# Altium schematic sheet MODULE.SchDoc: MODULE
size A3; Author: Silvio Navaretti; CompanyName: ARDUINO; DrawnBy: Silvio Navaretti; Engineer: Silvio Navaretti; Organization: ARDUINO; SheetNumber: 2; SheetTotal: 51; RevAuthor: Silvio Navaretti
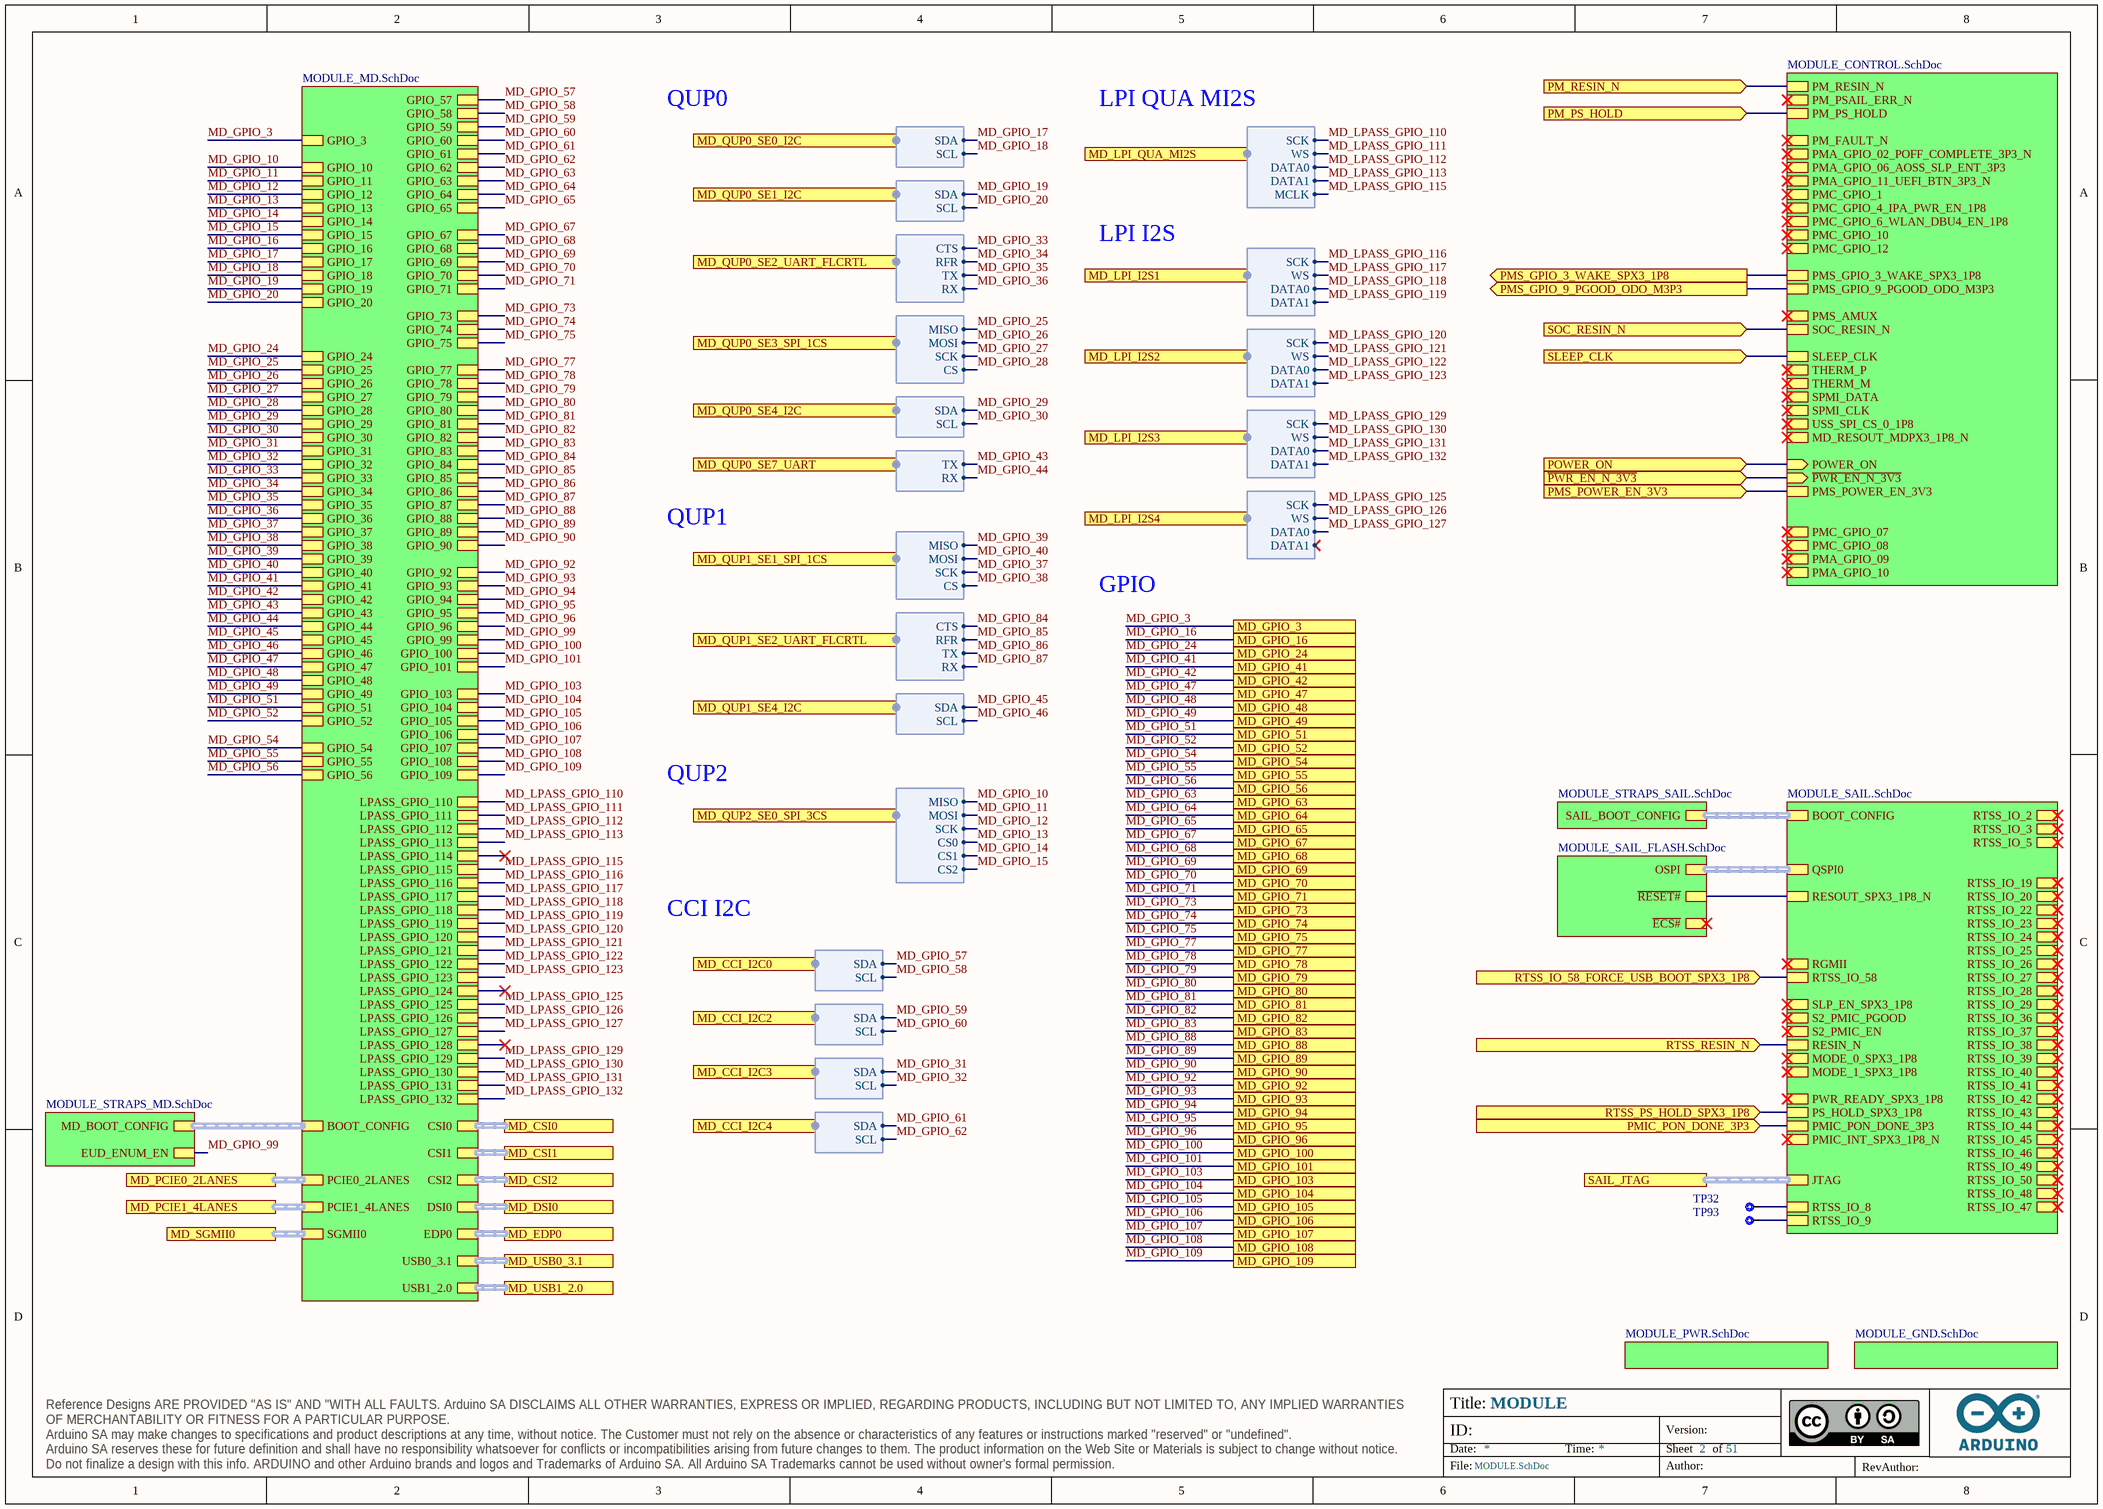
[diagram p0: MODULE.SchDoc]

## Parts
TP32  Test point 1.00mm  [TP-1.00MM]  (value not drawn)  (no BOM)
TP93  Test point 1.00mm  [TP-1.00MM]  (value not drawn)  (no BOM)

## Sub-sheets
MODULE_CONTROL = MODULE_CONTROL.SchDoc: PM_RESIN_N, PM_PSAIL_ERR_N, PM_PS_HOLD, PM_FAULT_N, PMA_GPIO_02_POFF_COMPLETE_3P3_N, PMA_GPIO_06_AOSS_SLP_ENT_3P3, PMA_GPIO_11_UEFI_BTN_3P3_N, PMC_GPIO_1, PMC_GPIO_4_IPA_PWR_EN_1P8, PMC_GPIO_6_WLAN_DBU4_EN_1P8, PMC_GPIO_10, PMC_GPIO_12, PMS_GPIO_3_WAKE_SPX3_1P8, PMS_GPIO_9_PGOOD_ODO_M3P3, PMS_AMUX, SOC_RESIN_N, SLEEP_CLK, THERM_P, THERM_M, SPMI_DATA, SPMI_CLK, USS_SPI_CS_0_1P8, MD_RESOUT_MDPX3_1P8_N, POWER_ON (in), ~{PWR_EN_N_3V3} (in), PMA_GPIO_09, PMA_GPIO_10, PMC_GPIO_07, PMC_GPIO_08, PMS_POWER_EN_3V3
MODULE_GND = MODULE_GND.SchDoc: no entries
MODULE_PWR = MODULE_PWR.SchDoc: no entries
MODULE_SAIL = MODULE_SAIL.SchDoc: JTAG (harness SOM_SAIL_JTAG), RGMII (harness SOM_SAIL_RGMII), SLP_EN_SPX3_1P8, S2_PMIC_PGOOD, S2_PMIC_EN, RESIN_N, MODE_0_SPX3_1P8, MODE_1_SPX3_1P8, PWR_READY_SPX3_1P8, PS_HOLD_SPX3_1P8, PMIC_PON_DONE_3P3, PMIC_INT_SPX3_1P8_N, BOOT_CONFIG (harness SOM_SAIL_BOOT_CONFIG), RTSS_IO_2, RTSS_IO_3, RTSS_IO_5, RTSS_IO_8, RTSS_IO_9, RTSS_IO_19, RTSS_IO_20, RTSS_IO_22, RTSS_IO_23, RTSS_IO_24, RTSS_IO_25, RTSS_IO_26, RTSS_IO_27, RTSS_IO_28, RTSS_IO_29, RTSS_IO_36, RTSS_IO_37, RTSS_IO_38, RTSS_IO_39, RTSS_IO_40, RTSS_IO_41, RTSS_IO_42, RTSS_IO_43, RTSS_IO_44, RTSS_IO_45, RTSS_IO_46, RTSS_IO_49, RTSS_IO_50, RTSS_IO_58, RTSS_IO_48, RTSS_IO_47, RESOUT_SPX3_1P8_N, QSPI0 (harness SOM_SAIL_QSPI0)
MODULE_SAIL_FLASH = MODULE_SAIL_FLASH.SchDoc: ~{RESET#}, ~{ECS#}, OSPI (harness SOM_SAIL_QSPI0)
MODULE_STRAPS_MD = MODULE_STRAPS_MD.SchDoc: MD_BOOT_CONFIG (harness SOM_MD_BOOT_CONFIG), EUD_ENUM_EN
MODULE_STRAPS_SAIL = MODULE_STRAPS_SAIL.SchDoc: SAIL_BOOT_CONFIG (harness SOM_SAIL_BOOT_CONFIG)
U_SOM_MD = MODULE_MD.SchDoc: GPIO_3, GPIO_10, GPIO_11, GPIO_12, GPIO_13, GPIO_14, GPIO_15, GPIO_16, GPIO_17, GPIO_18, GPIO_19, GPIO_20, GPIO_24, GPIO_25, GPIO_26, GPIO_27, GPIO_28, GPIO_29, GPIO_30, GPIO_31, GPIO_32, GPIO_33, GPIO_34, GPIO_35, GPIO_36, GPIO_37, GPIO_38, GPIO_39, GPIO_40, GPIO_42, GPIO_43, GPIO_45, GPIO_46, GPIO_47, GPIO_48, GPIO_52, GPIO_54, GPIO_55, GPIO_56, GPIO_57, GPIO_58, GPIO_59, GPIO_60, GPIO_61, GPIO_62, GPIO_63, GPIO_64, GPIO_65, GPIO_67, GPIO_68, GPIO_69, GPIO_70, GPIO_71, GPIO_73, GPIO_74, GPIO_75, GPIO_77, GPIO_78, GPIO_79, GPIO_80, GPIO_81, GPIO_83, GPIO_84, GPIO_85, GPIO_86, GPIO_87, GPIO_88, GPIO_89, GPIO_90, GPIO_92, GPIO_93, GPIO_94, GPIO_95, GPIO_99, GPIO_100, GPIO_101, GPIO_104, GPIO_105, GPIO_106, GPIO_107, GPIO_108, GPIO_109, LPASS_GPIO_110, LPASS_GPIO_111, LPASS_GPIO_112, LPASS_GPIO_113, LPASS_GPIO_114, LPASS_GPIO_115, LPASS_GPIO_116, LPASS_GPIO_117, LPASS_GPIO_118, LPASS_GPIO_119, LPASS_GPIO_120, LPASS_GPIO_121, LPASS_GPIO_122, LPASS_GPIO_123, LPASS_GPIO_124, LPASS_GPIO_125, LPASS_GPIO_126, LPASS_GPIO_127, LPASS_GPIO_128, LPASS_GPIO_129, LPASS_GPIO_130, LPASS_GPIO_131, LPASS_GPIO_132, SGMII0 (harness SOM_MD_SGMII0), EDP0 (harness SOM_MD_EDP0), USB0_3.1 (harness SOM_MD_USB0), USB1_2.0 (harness SOM_MD_USB1), PCIE1_4LANES (harness SOM_MD_PCIE1), BOOT_CONFIG (harness SOM_MD_BOOT_CONFIG), GPIO_44, CSI0 (harness MIPI_4LANES), CSI1 (harness MIPI_4LANES), CSI2 (harness MIPI_4LANES), DSI0 (harness MIPI_4LANES), GPIO_103, GPIO_82, GPIO_41, GPIO_96, GPIO_49, GPIO_51, PCIE0_2LANES (harness SOM_MD_PCIE0)

## Ports
MD_CCI_I2C0 (harness I2C), MD_CCI_I2C2 (harness I2C), MD_CCI_I2C3 (harness I2C), MD_CCI_I2C4 (harness I2C), MD_CSI0, MD_CSI1, MD_CSI2, MD_DSI0, MD_EDP0, MD_GPIO_3, MD_GPIO_16, MD_GPIO_24, MD_GPIO_41, MD_GPIO_42, MD_GPIO_47, MD_GPIO_48, MD_GPIO_49, MD_GPIO_51, MD_GPIO_52, MD_GPIO_54, MD_GPIO_55, MD_GPIO_56, MD_GPIO_63, MD_GPIO_64, MD_GPIO_65, MD_GPIO_67, MD_GPIO_68, MD_GPIO_69, MD_GPIO_70, MD_GPIO_71, MD_GPIO_73, MD_GPIO_74, MD_GPIO_75, MD_GPIO_77, MD_GPIO_78, MD_GPIO_79, MD_GPIO_80, MD_GPIO_81, MD_GPIO_82, MD_GPIO_83, MD_GPIO_88, MD_GPIO_89, MD_GPIO_90, MD_GPIO_92, MD_GPIO_93, MD_GPIO_94, MD_GPIO_95, MD_GPIO_96, MD_GPIO_100, MD_GPIO_101, MD_GPIO_103, MD_GPIO_104, MD_GPIO_105, MD_GPIO_106, MD_GPIO_107, MD_GPIO_108, MD_GPIO_109, MD_LPI_I2S1 (harness SOM_MD_I2S), MD_LPI_I2S2 (harness SOM_MD_I2S), MD_LPI_I2S3 (harness SOM_MD_I2S), MD_LPI_I2S4 (harness SOM_MD_I2S), MD_LPI_QUA_MI2S (harness SOM_MD_I2S_QUA), MD_PCIE0_2LANES, MD_PCIE1_4LANES, MD_QUP0_SE0_I2C (harness I2C), MD_QUP0_SE1_I2C (harness I2C), MD_QUP0_SE2_UART_FLCRTL (harness SOM_MD_UART_FLCRTL), MD_QUP0_SE3_SPI_1CS (harness SPI), MD_QUP0_SE4_I2C (harness I2C), MD_QUP0_SE7_UART (harness UART), MD_QUP1_SE1_SPI_1CS (harness SPI), MD_QUP1_SE2_UART_FLCRTL (harness SOM_MD_UART_FLCRTL), MD_QUP1_SE4_I2C (harness I2C), MD_QUP2_SE0_SPI_3CS (harness SOM_MD_SPI_3CS), MD_SGMII0, MD_USB0_3.1, MD_USB1_2.0, PM_PS_HOLD (in), PM_RESIN_N (in), PMIC_PON_DONE_3P3 (in), PMS_GPIO_3_WAKE_SPX3_1P8 (out), PMS_GPIO_9_PGOOD_ODO_M3P3 (out), PMS_POWER_EN_3V3 (in), POWER_ON (in), RTSS_IO_58_FORCE_USB_BOOT_SPX3_1P8 (in), RTSS_PS_HOLD_SPX3_1P8 (in), RTSS_RESIN_N (in), SAIL_JTAG, SLEEP_CLK (in), SOC_RESIN_N (in), ~{PWR_EN_N_3V3} (in)

## Harnesses
I2C: SDA, SCL
SOM_MD_I2S_QUA: SCK, WS, DATA0, DATA1, MCLK
SOM_MD_I2S: SCK, WS, DATA0, DATA1
SPI: SCK, MISO, MOSI, CS
SOM_MD_UART_FLCRTL: TX, CTS, RFR, RX
UART: TX, RX
SOM_MD_SPI_3CS: SCK, MISO, MOSI, CS0, CS1, CS2

## Nets
MD_GPIO_3: port MD_GPIO_3, sheet U_SOM_MD/GPIO_3
MD_GPIO_10: sheet U_SOM_MD/GPIO_10, port MD_QUP2_SE0_SPI_3CS.MISO
MD_GPIO_11: sheet U_SOM_MD/GPIO_11, port MD_QUP2_SE0_SPI_3CS.MOSI
MD_GPIO_12: sheet U_SOM_MD/GPIO_12, port MD_QUP2_SE0_SPI_3CS.SCK
MD_GPIO_13: sheet U_SOM_MD/GPIO_13, port MD_QUP2_SE0_SPI_3CS.CS0
MD_GPIO_14: sheet U_SOM_MD/GPIO_14, port MD_QUP2_SE0_SPI_3CS.CS1
MD_GPIO_15: sheet U_SOM_MD/GPIO_15, port MD_QUP2_SE0_SPI_3CS.CS2
MD_GPIO_16: port MD_GPIO_16, sheet U_SOM_MD/GPIO_16
MD_GPIO_17: sheet U_SOM_MD/GPIO_17, port MD_QUP0_SE0_I2C.SDA
MD_GPIO_18: sheet U_SOM_MD/GPIO_18, port MD_QUP0_SE0_I2C.SCL
MD_GPIO_19: sheet U_SOM_MD/GPIO_19, port MD_QUP0_SE1_I2C.SDA
MD_GPIO_20: sheet U_SOM_MD/GPIO_20, port MD_QUP0_SE1_I2C.SCL
MD_GPIO_24: port MD_GPIO_24, sheet U_SOM_MD/GPIO_24
MD_GPIO_25: sheet U_SOM_MD/GPIO_25, port MD_QUP0_SE3_SPI_1CS.MISO
MD_GPIO_26: sheet U_SOM_MD/GPIO_26, port MD_QUP0_SE3_SPI_1CS.MOSI
MD_GPIO_27: sheet U_SOM_MD/GPIO_27, port MD_QUP0_SE3_SPI_1CS.SCK
MD_GPIO_28: sheet U_SOM_MD/GPIO_28, port MD_QUP0_SE3_SPI_1CS.CS
MD_GPIO_29: sheet U_SOM_MD/GPIO_29, port MD_QUP0_SE4_I2C.SDA
MD_GPIO_30: sheet U_SOM_MD/GPIO_30, port MD_QUP0_SE4_I2C.SCL
MD_GPIO_31: sheet U_SOM_MD/GPIO_31, port MD_CCI_I2C3.SDA
MD_GPIO_32: sheet U_SOM_MD/GPIO_32, port MD_CCI_I2C3.SCL
MD_GPIO_33: sheet U_SOM_MD/GPIO_33, port MD_QUP0_SE2_UART_FLCRTL.CTS
MD_GPIO_34: sheet U_SOM_MD/GPIO_34, port MD_QUP0_SE2_UART_FLCRTL.RFR
MD_GPIO_35: sheet U_SOM_MD/GPIO_35, port MD_QUP0_SE2_UART_FLCRTL.TX
MD_GPIO_36: sheet U_SOM_MD/GPIO_36, port MD_QUP0_SE2_UART_FLCRTL.RX
MD_GPIO_37: sheet U_SOM_MD/GPIO_37, port MD_QUP1_SE1_SPI_1CS.SCK
MD_GPIO_38: sheet U_SOM_MD/GPIO_38, port MD_QUP1_SE1_SPI_1CS.CS
MD_GPIO_39: sheet U_SOM_MD/GPIO_39, port MD_QUP1_SE1_SPI_1CS.MISO
MD_GPIO_40: sheet U_SOM_MD/GPIO_40, port MD_QUP1_SE1_SPI_1CS.MOSI
MD_GPIO_41: port MD_GPIO_41, sheet U_SOM_MD/GPIO_41
MD_GPIO_42: port MD_GPIO_42, sheet U_SOM_MD/GPIO_42
MD_GPIO_43: sheet U_SOM_MD/GPIO_43, port MD_QUP0_SE7_UART.TX
MD_GPIO_44: sheet U_SOM_MD/GPIO_44, port MD_QUP0_SE7_UART.RX
MD_GPIO_45: sheet U_SOM_MD/GPIO_45, port MD_QUP1_SE4_I2C.SDA
MD_GPIO_46: sheet U_SOM_MD/GPIO_46, port MD_QUP1_SE4_I2C.SCL
MD_GPIO_47: port MD_GPIO_47, sheet U_SOM_MD/GPIO_47
MD_GPIO_48: port MD_GPIO_48, sheet U_SOM_MD/GPIO_48
MD_GPIO_49: port MD_GPIO_49, sheet U_SOM_MD/GPIO_49
MD_GPIO_51: port MD_GPIO_51, sheet U_SOM_MD/GPIO_51
MD_GPIO_52: port MD_GPIO_52, sheet U_SOM_MD/GPIO_52
MD_GPIO_54: port MD_GPIO_54, sheet U_SOM_MD/GPIO_54
MD_GPIO_55: port MD_GPIO_55, sheet U_SOM_MD/GPIO_55
MD_GPIO_56: port MD_GPIO_56, sheet U_SOM_MD/GPIO_56
MD_GPIO_57: sheet U_SOM_MD/GPIO_57, port MD_CCI_I2C0.SDA
MD_GPIO_58: sheet U_SOM_MD/GPIO_58, port MD_CCI_I2C0.SCL
MD_GPIO_59: sheet U_SOM_MD/GPIO_59, port MD_CCI_I2C2.SDA
MD_GPIO_60: sheet U_SOM_MD/GPIO_60, port MD_CCI_I2C2.SCL
MD_GPIO_61: sheet U_SOM_MD/GPIO_61, port MD_CCI_I2C4.SDA
MD_GPIO_62: sheet U_SOM_MD/GPIO_62, port MD_CCI_I2C4.SCL
MD_GPIO_63: port MD_GPIO_63, sheet U_SOM_MD/GPIO_63
MD_GPIO_64: port MD_GPIO_64, sheet U_SOM_MD/GPIO_64
MD_GPIO_65: port MD_GPIO_65, sheet U_SOM_MD/GPIO_65
MD_GPIO_67: port MD_GPIO_67, sheet U_SOM_MD/GPIO_67
MD_GPIO_68: port MD_GPIO_68, sheet U_SOM_MD/GPIO_68
MD_GPIO_69: port MD_GPIO_69, sheet U_SOM_MD/GPIO_69
MD_GPIO_70: port MD_GPIO_70, sheet U_SOM_MD/GPIO_70
MD_GPIO_71: port MD_GPIO_71, sheet U_SOM_MD/GPIO_71
MD_GPIO_73: port MD_GPIO_73, sheet U_SOM_MD/GPIO_73
MD_GPIO_74: port MD_GPIO_74, sheet U_SOM_MD/GPIO_74
MD_GPIO_75: port MD_GPIO_75, sheet U_SOM_MD/GPIO_75
MD_GPIO_77: port MD_GPIO_77, sheet U_SOM_MD/GPIO_77
MD_GPIO_78: port MD_GPIO_78, sheet U_SOM_MD/GPIO_78
MD_GPIO_79: port MD_GPIO_79, sheet U_SOM_MD/GPIO_79
MD_GPIO_80: port MD_GPIO_80, sheet U_SOM_MD/GPIO_80
MD_GPIO_81: port MD_GPIO_81, sheet U_SOM_MD/GPIO_81
MD_GPIO_82: port MD_GPIO_82, sheet U_SOM_MD/GPIO_82
MD_GPIO_83: port MD_GPIO_83, sheet U_SOM_MD/GPIO_83
MD_GPIO_84: sheet U_SOM_MD/GPIO_84, port MD_QUP1_SE2_UART_FLCRTL.CTS
MD_GPIO_85: sheet U_SOM_MD/GPIO_85, port MD_QUP1_SE2_UART_FLCRTL.RFR
MD_GPIO_86: sheet U_SOM_MD/GPIO_86, port MD_QUP1_SE2_UART_FLCRTL.TX
MD_GPIO_87: sheet U_SOM_MD/GPIO_87, port MD_QUP1_SE2_UART_FLCRTL.RX
MD_GPIO_88: port MD_GPIO_88, sheet U_SOM_MD/GPIO_88
MD_GPIO_89: port MD_GPIO_89, sheet U_SOM_MD/GPIO_89
MD_GPIO_90: port MD_GPIO_90, sheet U_SOM_MD/GPIO_90
MD_GPIO_92: port MD_GPIO_92, sheet U_SOM_MD/GPIO_92
MD_GPIO_93: port MD_GPIO_93, sheet U_SOM_MD/GPIO_93
MD_GPIO_94: port MD_GPIO_94, sheet U_SOM_MD/GPIO_94
MD_GPIO_95: port MD_GPIO_95, sheet U_SOM_MD/GPIO_95
MD_GPIO_96: port MD_GPIO_96, sheet U_SOM_MD/GPIO_96
MD_GPIO_99: sheet U_SOM_MD/GPIO_99, sheet MODULE_STRAPS_MD/EUD_ENUM_EN
MD_GPIO_100: port MD_GPIO_100, sheet U_SOM_MD/GPIO_100
MD_GPIO_101: port MD_GPIO_101, sheet U_SOM_MD/GPIO_101
MD_GPIO_103: port MD_GPIO_103, sheet U_SOM_MD/GPIO_103
MD_GPIO_104: port MD_GPIO_104, sheet U_SOM_MD/GPIO_104
MD_GPIO_105: port MD_GPIO_105, sheet U_SOM_MD/GPIO_105
MD_GPIO_106: port MD_GPIO_106, sheet U_SOM_MD/GPIO_106
MD_GPIO_107: port MD_GPIO_107, sheet U_SOM_MD/GPIO_107
MD_GPIO_108: port MD_GPIO_108, sheet U_SOM_MD/GPIO_108
MD_GPIO_109: port MD_GPIO_109, sheet U_SOM_MD/GPIO_109
MD_LPASS_GPIO_110: sheet U_SOM_MD/LPASS_GPIO_110, port MD_LPI_QUA_MI2S.SCK
MD_LPASS_GPIO_111: sheet U_SOM_MD/LPASS_GPIO_111, port MD_LPI_QUA_MI2S.WS
MD_LPASS_GPIO_112: sheet U_SOM_MD/LPASS_GPIO_112, port MD_LPI_QUA_MI2S.DATA0
MD_LPASS_GPIO_113: sheet U_SOM_MD/LPASS_GPIO_113, port MD_LPI_QUA_MI2S.DATA1
MD_LPASS_GPIO_115: sheet U_SOM_MD/LPASS_GPIO_115, port MD_LPI_QUA_MI2S.MCLK
MD_LPASS_GPIO_116: sheet U_SOM_MD/LPASS_GPIO_116, port MD_LPI_I2S1.SCK
MD_LPASS_GPIO_117: sheet U_SOM_MD/LPASS_GPIO_117, port MD_LPI_I2S1.WS
MD_LPASS_GPIO_118: sheet U_SOM_MD/LPASS_GPIO_118, port MD_LPI_I2S1.DATA0
MD_LPASS_GPIO_119: sheet U_SOM_MD/LPASS_GPIO_119, port MD_LPI_I2S1.DATA1
MD_LPASS_GPIO_120: sheet U_SOM_MD/LPASS_GPIO_120, port MD_LPI_I2S2.SCK
MD_LPASS_GPIO_121: sheet U_SOM_MD/LPASS_GPIO_121, port MD_LPI_I2S2.WS
MD_LPASS_GPIO_122: sheet U_SOM_MD/LPASS_GPIO_122, port MD_LPI_I2S2.DATA0
MD_LPASS_GPIO_123: sheet U_SOM_MD/LPASS_GPIO_123, port MD_LPI_I2S2.DATA1
MD_LPASS_GPIO_125: sheet U_SOM_MD/LPASS_GPIO_125, port MD_LPI_I2S4.SCK
MD_LPASS_GPIO_126: sheet U_SOM_MD/LPASS_GPIO_126, port MD_LPI_I2S4.WS
MD_LPASS_GPIO_127: sheet U_SOM_MD/LPASS_GPIO_127, port MD_LPI_I2S4.DATA0
MD_LPASS_GPIO_129: sheet U_SOM_MD/LPASS_GPIO_129, port MD_LPI_I2S3.SCK
MD_LPASS_GPIO_130: sheet U_SOM_MD/LPASS_GPIO_130, port MD_LPI_I2S3.WS
MD_LPASS_GPIO_131: sheet U_SOM_MD/LPASS_GPIO_131, port MD_LPI_I2S3.DATA0
MD_LPASS_GPIO_132: sheet U_SOM_MD/LPASS_GPIO_132, port MD_LPI_I2S3.DATA1
~{PWR_EN_N_3V3}: port ~{PWR_EN_N_3V3}, sheet MODULE_CONTROL/~{PWR_EN_N_3V3}
PM_PS_HOLD: port PM_PS_HOLD, sheet MODULE_CONTROL/PM_PS_HOLD
PM_RESIN_N: port PM_RESIN_N, sheet MODULE_CONTROL/PM_RESIN_N
PMIC_PON_DONE_3P3: port PMIC_PON_DONE_3P3, sheet MODULE_SAIL/PMIC_PON_DONE_3P3
PMS_GPIO_3_WAKE_SPX3_1P8: port PMS_GPIO_3_WAKE_SPX3_1P8, sheet MODULE_CONTROL/PMS_GPIO_3_WAKE_SPX3_1P8
PMS_GPIO_9_PGOOD_ODO_M3P3: port PMS_GPIO_9_PGOOD_ODO_M3P3, sheet MODULE_CONTROL/PMS_GPIO_9_PGOOD_ODO_M3P3
PMS_POWER_EN_3V3: port PMS_POWER_EN_3V3, sheet MODULE_CONTROL/PMS_POWER_EN_3V3
POWER_ON: port POWER_ON, sheet MODULE_CONTROL/POWER_ON
RTSS_IO_58_FORCE_USB_BOOT_SPX3_1P8: port RTSS_IO_58_FORCE_USB_BOOT_SPX3_1P8, sheet MODULE_SAIL/RTSS_IO_58
RTSS_PS_HOLD_SPX3_1P8: port RTSS_PS_HOLD_SPX3_1P8, sheet MODULE_SAIL/PS_HOLD_SPX3_1P8
RTSS_RESIN_N: port RTSS_RESIN_N, sheet MODULE_SAIL/RESIN_N
SLEEP_CLK: port SLEEP_CLK, sheet MODULE_CONTROL/SLEEP_CLK
SOC_RESIN_N: port SOC_RESIN_N, sheet MODULE_CONTROL/SOC_RESIN_N
NetTP32_X: TP32.X ; sheet MODULE_SAIL/RTSS_IO_8
NetTP93_X: TP93.X ; sheet MODULE_SAIL/RTSS_IO_9
(unnamed): sheet MODULE_SAIL/RESOUT_SPX3_1P8_N, sheet MODULE_SAIL_FLASH/~{RESET#}

## Buses and harness runs
harness port MD_CSI0 = sheet U_SOM_MD/CSI0
harness port MD_CSI1 = sheet U_SOM_MD/CSI1
harness port MD_CSI2 = sheet U_SOM_MD/CSI2
harness port MD_DSI0 = sheet U_SOM_MD/DSI0
harness port MD_EDP0 = sheet U_SOM_MD/EDP0
harness port MD_PCIE0_2LANES = sheet U_SOM_MD/PCIE0_2LANES
harness port MD_PCIE1_4LANES = sheet U_SOM_MD/PCIE1_4LANES
harness port MD_SGMII0 = sheet U_SOM_MD/SGMII0
harness port MD_USB0_3.1 = sheet U_SOM_MD/USB0_3.1
harness port MD_USB1_2.0 = sheet U_SOM_MD/USB1_2.0
harness port SAIL_JTAG = sheet MODULE_SAIL/JTAG
harness sheet MODULE_SAIL/BOOT_CONFIG = sheet MODULE_STRAPS_SAIL/SAIL_BOOT_CONFIG
harness sheet MODULE_SAIL/QSPI0 = sheet MODULE_SAIL_FLASH/OSPI
harness sheet MODULE_STRAPS_MD/MD_BOOT_CONFIG = sheet U_SOM_MD/BOOT_CONFIG

## Notes on the sheet
- QUP0
- LPI QUA MI2S
- LPI I2S
- QUP1
- GPIO
- QUP2
- CCI I2C
- Title:
- ID:
- Date:
- Time:
- Version:
- Sheet
- of
- RevAuthor:
- Reference Designs ARE PROVIDED "AS IS" AND "WITH ALL FAULTS. Arduino SA DISCLAIMS ALL OTHER WARRANTIES, EXPRESS OR IMPLIED, REGARDING PRODUCTS, INCLUDING BUT NOT LIMITED TO, ANY IMPLIED WARRANTIES OF MERCHANTABILITY OR FITNESS FOR A PARTICULAR PURPOSE.
  Arduino SA may make changes to specifications and product descriptions at any time, without notice. The Customer must not rely on the absence or characteristics of any features or instructions marked "reserved" or "undefined".
  Arduino SA reserves these for future definition and shall have no responsibility whatsoever for conflicts or incompatibilities arising from future changes to them. The product information on the Web Site or Materials is subject to change without notice.
  Do not finalize a design with this info. ARDUINO and other Arduino brands and logos and Trademarks of Arduino SA. All Arduino SA Trademarks cannot be used without owner's formal permission.
- File:
- Author:

## Library data of the parts
TP32 TP93 = UT0013-A.6: Part Number: This is not a component; Design Item ID: CMP-018-0005-A.3; Source: ut.SchLib; Manufacturer: This is not a component; Code Arduino: This is not a component; Pin Count: 1